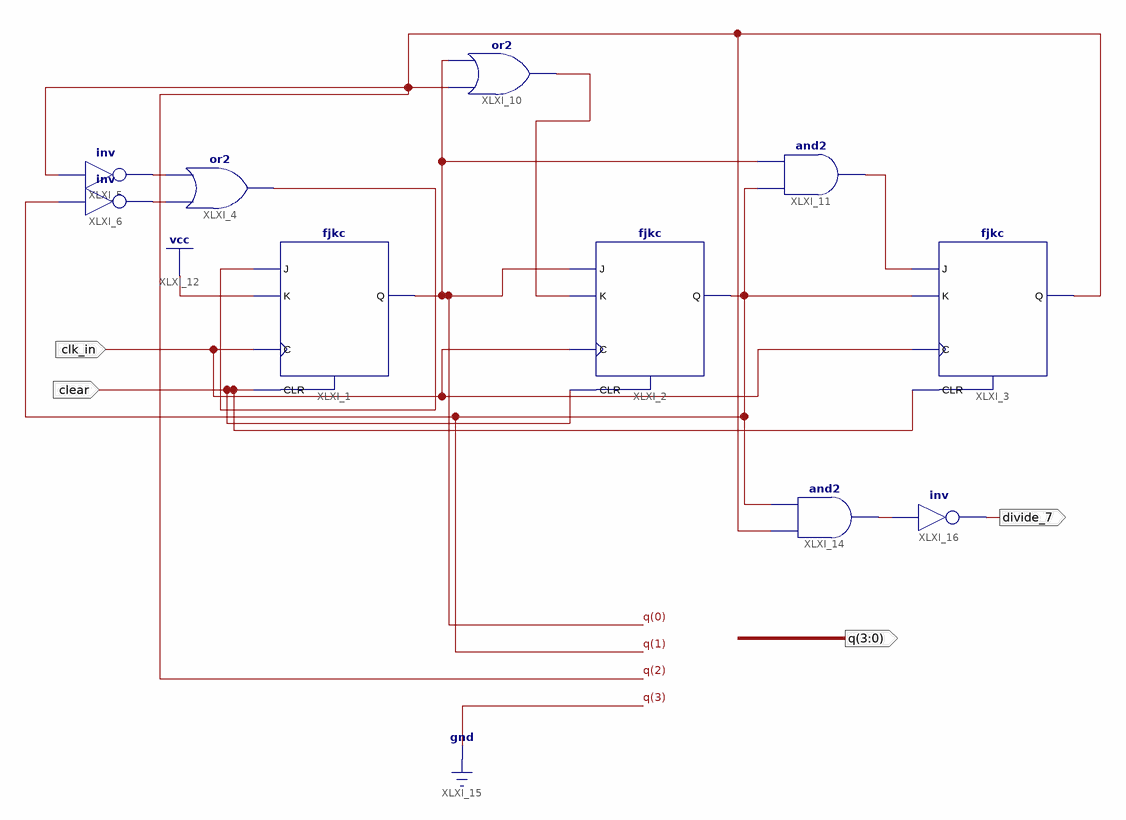
[diagram p0: schematic sheet 1]
// Xilinx ISE schematic counter06.sch (spartan6) as structural Verilog: 10 symbols, 4 ports
module counter06 (
  input  clk_in,
  input  clear,
  output [3:0] q,
  output divide_7
);

  wire XLXN_1, XLXN_2, XLXN_7, XLXN_10, XLXN_13, XLXN_23;

  fjkc XLXI_1 (.C(clk_in), .CLR(clear), .J(XLXN_13), .K(1'b1), .Q(q[0]));
  fjkc XLXI_2 (.C(clk_in), .CLR(clear), .J(q[0]), .K(XLXN_10), .Q(q[1]));
  fjkc XLXI_3 (.C(clk_in), .CLR(clear), .J(XLXN_7), .K(q[1]), .Q(q[2]));
  or XLXI_4 (XLXN_13, XLXN_2, XLXN_1);
  not XLXI_5 (XLXN_1, q[2]);
  not XLXI_6 (XLXN_2, q[1]);
  or XLXI_10 (XLXN_10, q[2], q[0]);
  and XLXI_11 (XLXN_7, q[1], q[0]);
  and XLXI_14 (XLXN_23, q[2], q[1]);
  not XLXI_16 (divide_7, XLXN_23);

  assign q[3] = 1'b0;
endmodule
